# Altium schematic sheet GRLV_double_Rail_v0.2b_P1.SchDoc
size A4
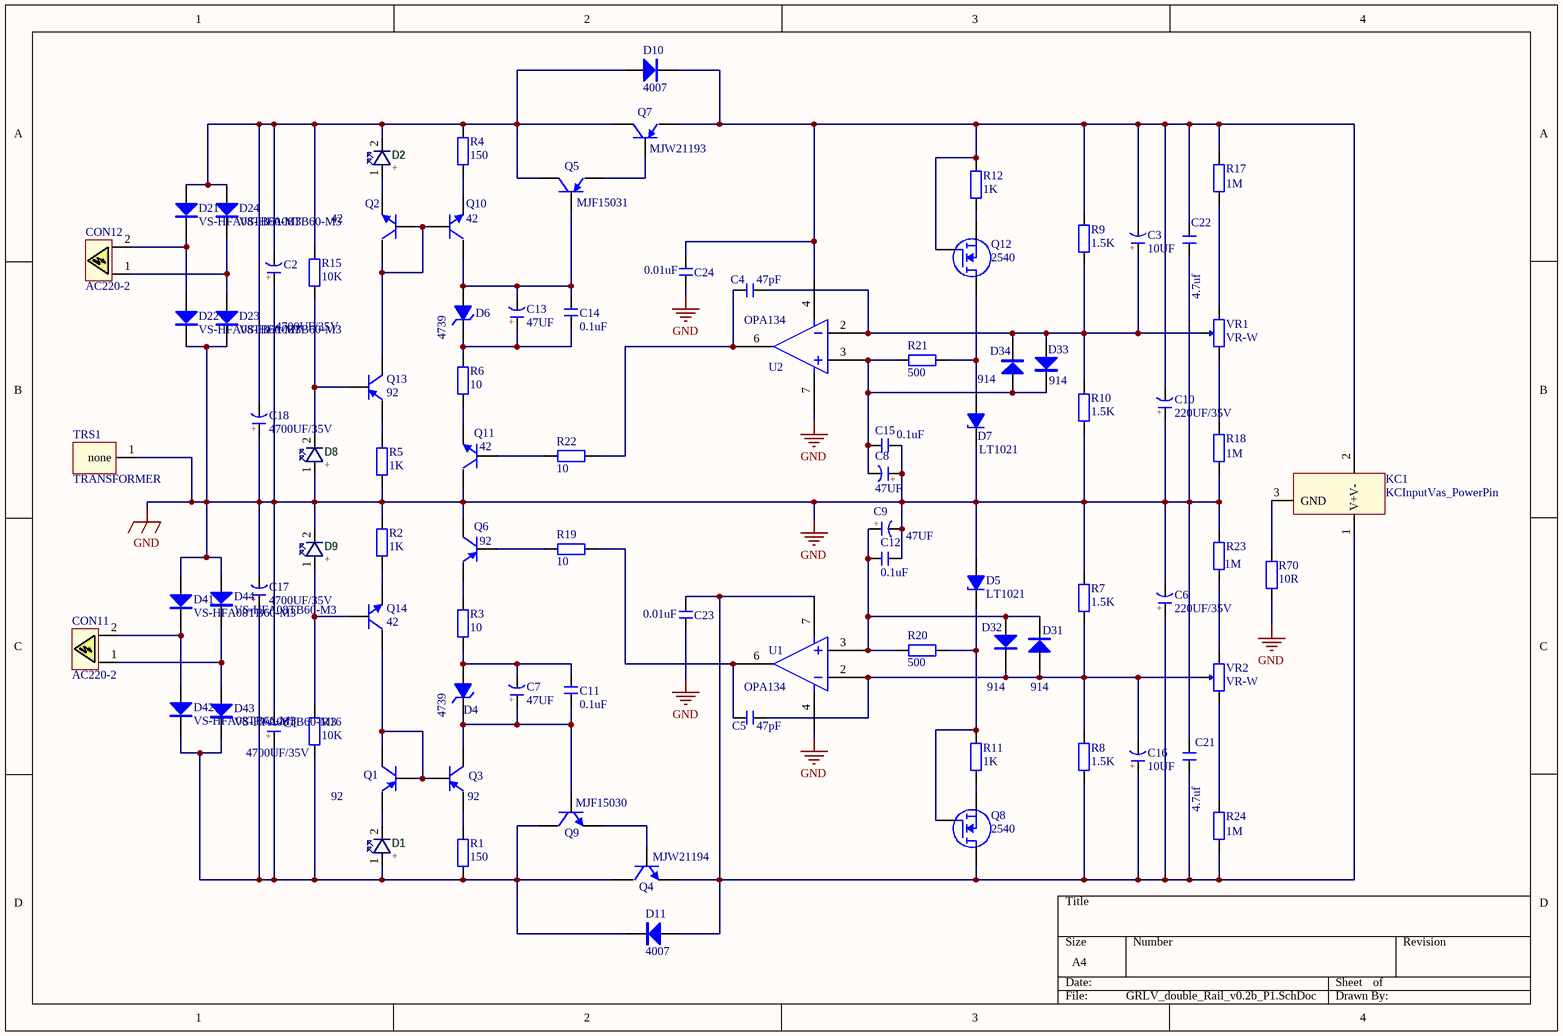
[diagram p0: GRLV_double_Rail_v0.2b_P1.SchDoc]

## Parts
C1  4700UF/35V  [CAP 10*22*31.5]
C2  4700UF/35V  [CAP 10*22*31.5]
C3  10UF  [CAP 2.5*6.3*7]
C4  47pF  [CBB 6.3*6.3*5]
C5  47pF  [CBB 6.3*6.3*5]
C6  220UF/35V  [CAP 5.0*10*12.5]
C7  47UF  [CAP 3.5*8*11.5]
C8  47UF  [CAP 2.5*6.3*11.2]
C9  47UF  [CAP 2.5*6.3*11.2]
C10  220UF/35V  [CAP 5.0*10*12.5]
C11  0.1uF  [CBB 6.3*6.3*5]
C12  0.1uF  [CBB 6.3*6.3*5]
C13  47UF  [CAP 3.5*8*11.5]
C14  0.1uF  [CBB 6.3*6.3*5]
C15  0.1uF  [CBB 6.3*6.3*5]
C16  10UF  [CAP 2.5*6.3*7]
C17  4700UF/35V  [CAP 10*22*31.5]
C18  4700UF/35V  [CAP 10*22*31.5]
C21  4.7uf  [CBB 7.2*7.2*13]
C22  4.7uf  [CBB 7.2*7.2*13]
C23  value 0.01uF  [CBB 6.3*6.3*5]  (hidden comment: .01)
C24  value 0.01uF  [CBB 6.3*6.3*5]  (hidden comment: .01)
CON11  AC220-2  [HX4.0-2XS]
CON12  AC220-2  [HX4.0-2XS]
D1  +  [LED 3MM-R]
D2  +  [LED 3MM-R]
D4  4739  [DO-41]
D5  LT1021  [DIP8-300_MH]
D6  4739  [DO-41]
D7  LT1021  [DIP8-300_MH]
D8  +  [LED 3MM-R]
D9  +  [LED 3MM-R]
D10  4007  [DO-41]
D11  4007  [DO-41]
D21  VS-HFA08TB60-M3  [DO-15XL]
D22  VS-HFA08TB60-M3  [DO-15XL]
D23  VS-HFA08TB60-M3  [DO-15XL]
D24  VS-HFA08TB60-M3  [DO-15XL]
D31  914  [DO-35]
D32  914  [DO-35]
D33  914  [DO-35]
D34  914  [DO-35]
D41  VS-HFA08TB60-M3  [DO-15XL]
D42  VS-HFA08TB60-M3  [DO-15XL]
D43  VS-HFA08TB60-M3  [DO-15XL]
D44  VS-HFA08TB60-M3  [DO-15XL]
KC1  KCInputVas_PowerPin  [KCIn_VAS_PowerPin_M4]
Q1  92  [TO92A]
Q2  42  [TO92A]
Q3  92  [TO92A]
Q4  MJW21194  [TO247V]
Q5  MJF15031  [TO220V]
Q6  92  [TO92A]
Q7  MJW21193  [TO247V]
Q8  2540  [TO92A]
Q9  MJF15030  [TO220V]
Q10  42  [TO92A]
Q11  42  [TO92A]
Q12  2540  [TO92A]
Q13  92  [TO92A]
Q14  42  [TO92A]
R1  150  [RS 1/4W]
R2  1K  [RS 1/4W]
R3  10  [RS 1/4W]
R4  150  [RS 1/4W]
R5  1K  [RS 1/4W]
R6  10  [RS 1/4W]
R7  1.5K  [RS 1/4W]
R8  1.5K  [RS 1/4W]
R9  1.5K  [RS 1/4W]
R10  1.5K  [RS 1/4W]
R11  1K  [RS 1/4W]
R12  1K  [RS 1/4W]
R15  10K  [RS 1/4W]
R16  10K  [RS 1/4W]
R17  1M  [RS 1/4W]
R18  1M  [RS 1/4W]
R19  10  [RS 1/4W]
R20  500  [RS 1/4W]
R21  500  [RS 1/4W]
R22  10  [RS 1/4W]
R23  1M  [RS 1/4W]
R24  1M  [RS 1/4W]
R70  10R  [RS 1/2W]
TRS1  TRANSFORMER  [TRANS_BLOCK_30W_24v]
U1  OPA134  [DIP8-300_MH]
U2  OPA134  [DIP8-300_MH]
VR1  VR-W  [RS 1/2W-VR]
VR2  VR-W  [RS 1/2W-VR]

## Nets
GND: C1.2(K) C2.1(A) C6.2(K) C8.1(A) C9.2(K) C10.1(A) C12.2 C15.2 C17.2(K) C18.1(A) C21.2 C22.1 C23.1 C24.1 D5.4(A) D7.6(K) D8.1(A) D9.2(K) D22.1(Cathode) D23.1(Cathode) D41.2(Anode) D44.2(Anode) Q6.3(C) Q11.3(C) R2.2 R5.1 R7.2 R10.1 R18.1 R23.2 R70.1 TRS1.1(none) U1.4(V-) U2.7(V+)
NetC1_1: C1.1(A) C17.1(A) D1.1(A) D11.2(K) D42.1(Cathode) D43.1(Cathode) Q4.2(C) Q9.2(C) R1.1 R16.1
NetC2_2: C2.2(K) C18.2(K) D2.2(K) D10.1(A) D21.2(Anode) D24.2(Anode) Q5.2(C) Q7.2(C) R4.2 R15.2
NetC3_1: C3.1(A) C4.2 D33.1(A) D34.2(K) R9.1 R10.2 U2.2(-in) VR1.3
NetC3_2: C3.2(K) C10.2(K) C22.2 C24.2 D10.2(K) KC1.2(V-) Q7.3(E) Q12.2(G) R9.2 R12.2 R17.2 U2.4(V-)
NetC4_1: C4.1 R22.2 U2.6(out)
NetC5_1: C5.1 R19.2 U1.6(out)
NetC5_2: C5.2 C16.2(K) D31.1(A) D32.2(K) R7.1 R8.2 U1.2(-in) VR2.3
NetC6_1: C6.1(A) C16.1(A) C21.1 C23.2 D11.1(A) KC1.1(V+) Q4.3(E) Q8.3(D) R8.1 R24.1 U1.7(V+)
NetC7_1: C7.1(A) C11.1 D4.2(K) Q3.3(C) Q9.1(B)
NetC7_2: C7.2(K) C11.2 D4.1(A) R3.1
NetC8_2: C8.2(K) C15.1 D33.2(K) D34.1(A) R21.1 U2.3(+in)
NetC9_1: C9.1(A) C12.1 D31.2(K) D32.1(A) R20.1 U1.3(+in)
NetC13_1: C13.1(A) C14.1 D6.2(K) R6.2
NetC13_2: C13.2(K) C14.2 D6.1(A) Q5.1(B) Q10.3(C)
NetCON11_1: CON11.1(L) D43.2(Anode) D44.1(Cathode)
NetCON11_2: CON11.2(G) D41.1(Cathode) D42.2(Anode)
NetCON12_1: CON12.1(L) D23.2(Anode) D24.1(Cathode)
NetCON12_2: CON12.2(G) D21.1(Cathode) D22.2(Anode)
NetD1_2: D1.2(K) Q1.1(E)
NetD2_1: D2.1(A) Q2.1(E)
NetD5_6: D5.6(K) Q8.2(G) R11.2 R20.2
NetD7_4: D7.4(A) Q12.3(D) R21.2
NetD8_2: D8.2(K) Q13.2(B) R15.1
NetD9_1: D9.1(A) Q14.2(B) R16.2
NetKC1_3: KC1.3(GND) R70.2
NetQ1_2: Q1.2(B) Q1.3(C) Q3.2(B) Q14.3(C)
NetQ2_2: Q2.2(B) Q2.3(C) Q10.2(B) Q13.3(C)
NetQ3_1: Q3.1(E) R1.2
NetQ4_1: Q4.1(B) Q9.3(E)
NetQ5_3: Q5.3(E) Q7.1(B)
NetQ6_1: Q6.1(E) R3.2
NetQ6_2: Q6.2(B) R19.1
NetQ8_1: Q8.1(S) R11.1
NetQ10_1: Q10.1(E) R4.1
NetQ11_1: Q11.1(E) R6.1
NetQ11_2: Q11.2(B) R22.1
NetQ12_1: Q12.1(S) R12.1
NetQ13_1: Q13.1(E) R5.2
NetQ14_1: Q14.1(E) R2.1
NetR17_1: R17.1 VR1.2
NetR18_2: R18.2 VR1.1
NetR23_1: R23.1 VR2.2
NetR24_2: R24.2 VR2.1

## Notes on the sheet
- (in symbol C-CAP) +

## Library data of the parts
C1-C3 C6-C10 C13 C16-C18 = C-CAP: 直插电解电容; 版权归属: 源创客; BOM名称: 直插电解电容; 学习资源: www.ooocke.com
C4 C5 C11 C12 C14 C15 C23 C24 = C-CBB: CBB电容; 版权归属: 源创客; BOM名称: CBB电容; 学习资源: www.ooocke.com
C21 C22 = C-MKS: MKS薄膜电容
D1 D2 D8 D9 = LED: 直插式LED
D4 D6 = 1N4739: 9.1V/1W稳压管
D5 D7 = LT1021-10-2P: 10V Precision Reference 2 Pin Config
D10 D11 = 1N4007: 整流二极管; 版权归属: 源创客; BOM名称: 整流二极管; 学习资源: www.ooocke.com
D21-D24 D41-D44 = VS-HFA08TB60-M3: Ultrafast Soft Recovery Diado 8A 600V; pin to pad: 1>2 2>1
D31-D34 = 1N914: 高速开关管 1V/0.25W
KC1 = KCInputVas_PowerPin: King Cello Input Stage and VAS
Q1 Q3 Q6 Q13 = KSP92/93: High Voltage PNP Transistor
Q2 Q10 Q11 Q14 = KSP42/43: High Voltage NPN Transistor
Q4 = MJW21194: Power NPN Transistor
Q5 = MJF15031: Power PNP Transistor
Q7 = MJW21193: Power PNP Transistor
Q8 Q12 = DN2540: N沟道耗尽型DMOS场效应管 400V/150ma
Q9 = MJF15030: Power NPN Transistor
R1-R12 R15-R24 R70 = R-CRR: 直插色环电阻; BOM名称: 色环电阻; 版权归属: 源创客; 学习资源: www.ooocke.com
  R4: Value: 150
  R9: Value: 1.5K
  R17 R18 R23 R24: Value: 1M
U1 U2 = OPA134PA
VR1 VR2 = VR-W: 直插可调电阻-顶调